# EAGLE schematic Motorsteuerung alte Version (EAGLE 6.0)
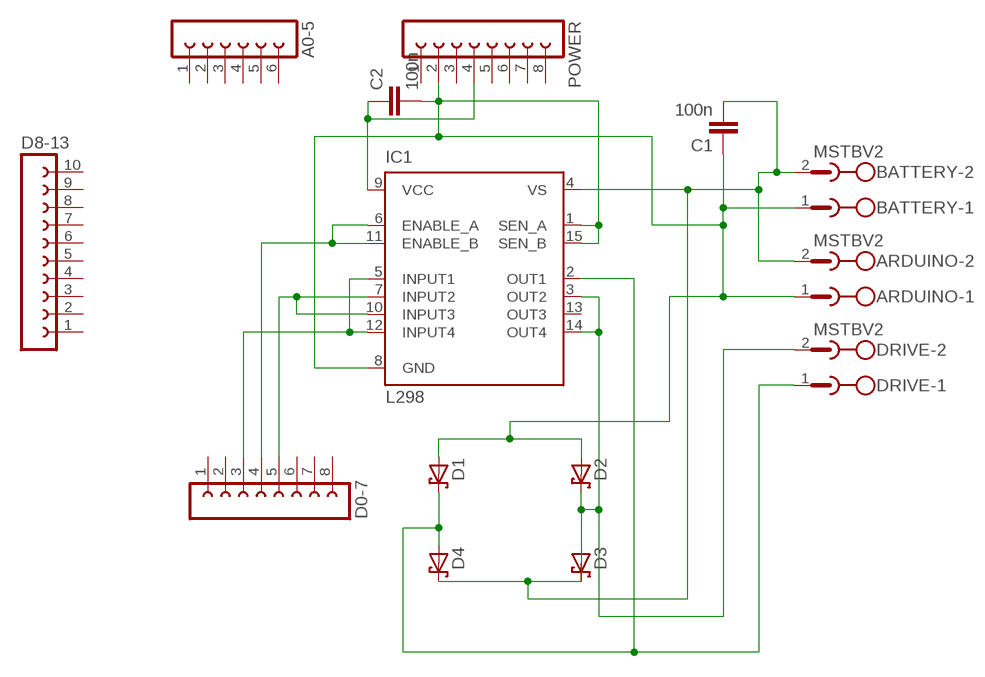
[diagram p0: schematic, sheet 1]

## Parts
A0-5  FE06-1  [FE06]
ARDUINO  MSTBV2  [MSTBV2]
BATTERY  MSTBV2  [MSTBV2]
C1  100n  C-EU025-030X050  [C025-030X050]
C2  100n  C-EU025-030X050  [C025-030X050]
D0-7  FE08-1  [FE08]
D1  SCHOTTKY-DIODEDO201T15  [DO201T15]
D2  SCHOTTKY-DIODEDO201T15  [DO201T15]
D3  SCHOTTKY-DIODEDO201T15  [DO201T15]
D4  SCHOTTKY-DIODEDO201T15  [DO201T15]
D8-13  FE10-1  [FE10]
DRIVE  MSTBV2  [MSTBV2]
IC1  L298  [MULTIWATT-15]
POWER  FE08-1  [FE08]

## Nets
N$1: D1.C D4.A DRIVE.1 IC1.2(OUT1)
N$2: ARDUINO.2 BATTERY.2 C1.2 D3.C D4.C IC1.4(VS)
N$5: D2.C D3.A DRIVE.2 IC1.3(OUT2) IC1.14(OUT4)
N$7: C2.1 IC1.9(VCC) POWER.4
N$8: D0-7.3 IC1.5(INPUT1) IC1.12(INPUT4)
N$9: ARDUINO.1 BATTERY.1 C1.1 C2.2 D1.A D2.A IC1.1(SEN_A) IC1.8(GND) IC1.15(SEN_B) POWER.2
N$10: D0-7.5 IC1.7(INPUT2) IC1.10(INPUT3)
N$11: D0-7.4 IC1.6(ENABLE_A) IC1.11(ENABLE_B)
Unconnected: A0-5.1 A0-5.2 A0-5.3 A0-5.4 A0-5.5 A0-5.6 D0-7.1 D0-7.2 D0-7.6 D0-7.7 D0-7.8 D8-13.1 D8-13.2 D8-13.3 D8-13.4 D8-13.5 D8-13.6 D8-13.7 D8-13.8 D8-13.9 D8-13.10 IC1.13(OUT3) POWER.1 POWER.3 POWER.5 POWER.6 POWER.7 POWER.8

## Library data of the parts
A0-5 = con-lsta:FE06-1: FEMALE HEADER; OC_FARNELL: unknown; OC_NEWARK: unknown
ARDUINO BATTERY DRIVE = con-phoenix-508:MSTBV2: PHOENIX; MPN: MSTBV 2,5/2-GF-5.08; OC_FARNELL: 1792792; OC_NEWARK: 69R9845
C1 C2 = rcl:C-EU: CAPACITOR, European symbol
D0-7 POWER = con-lsta:FE08-1: FEMALE HEADER; OC_FARNELL: unknown; OC_NEWARK: unknown
D1-D4 = diode:SCHOTTKY-DIODE: Schottky Diode
D8-13 = con-lsta:FE10-1: FEMALE HEADER; OC_FARNELL: unknown; OC_NEWARK: unknown
IC1 = st-microelectronics:L298: DUAL FULL-BRIDGE DRIVER; MPN: L298N; OC_FARNELL: 1589425; OC_NEWARK: 32M1527